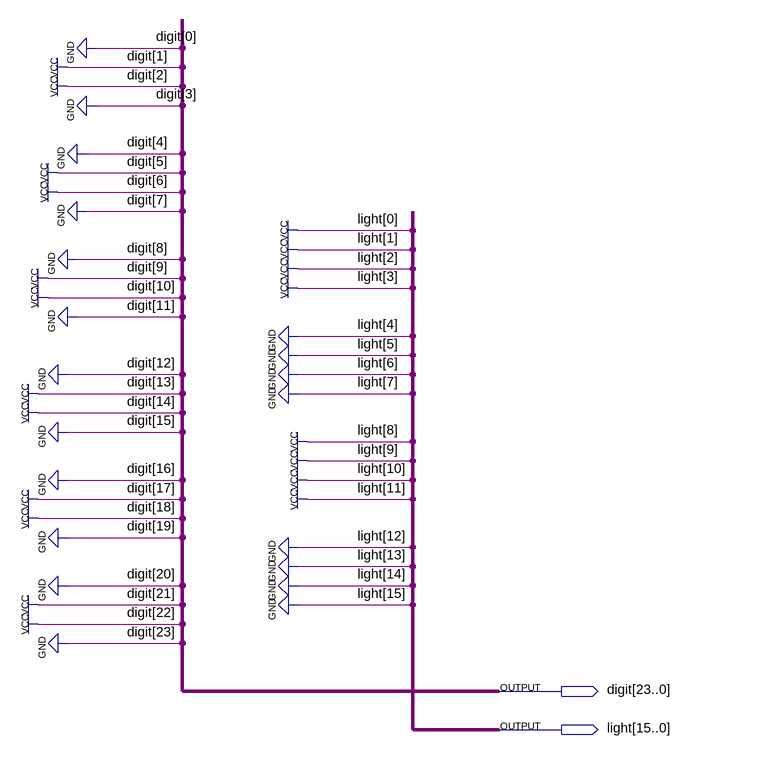
[diagram p0: schematic sheet]
// Quartus schematic Pattern_1_Frame_6.bdf as structural Verilog: 0 symbols, 2 pins
module Pattern_1_Frame_6 (
  output [23:0] digit,
  output [15:0] light
);


  assign digit = 24'b011001100110011001100110;
  assign light = 16'b0000111100001111;
endmodule
